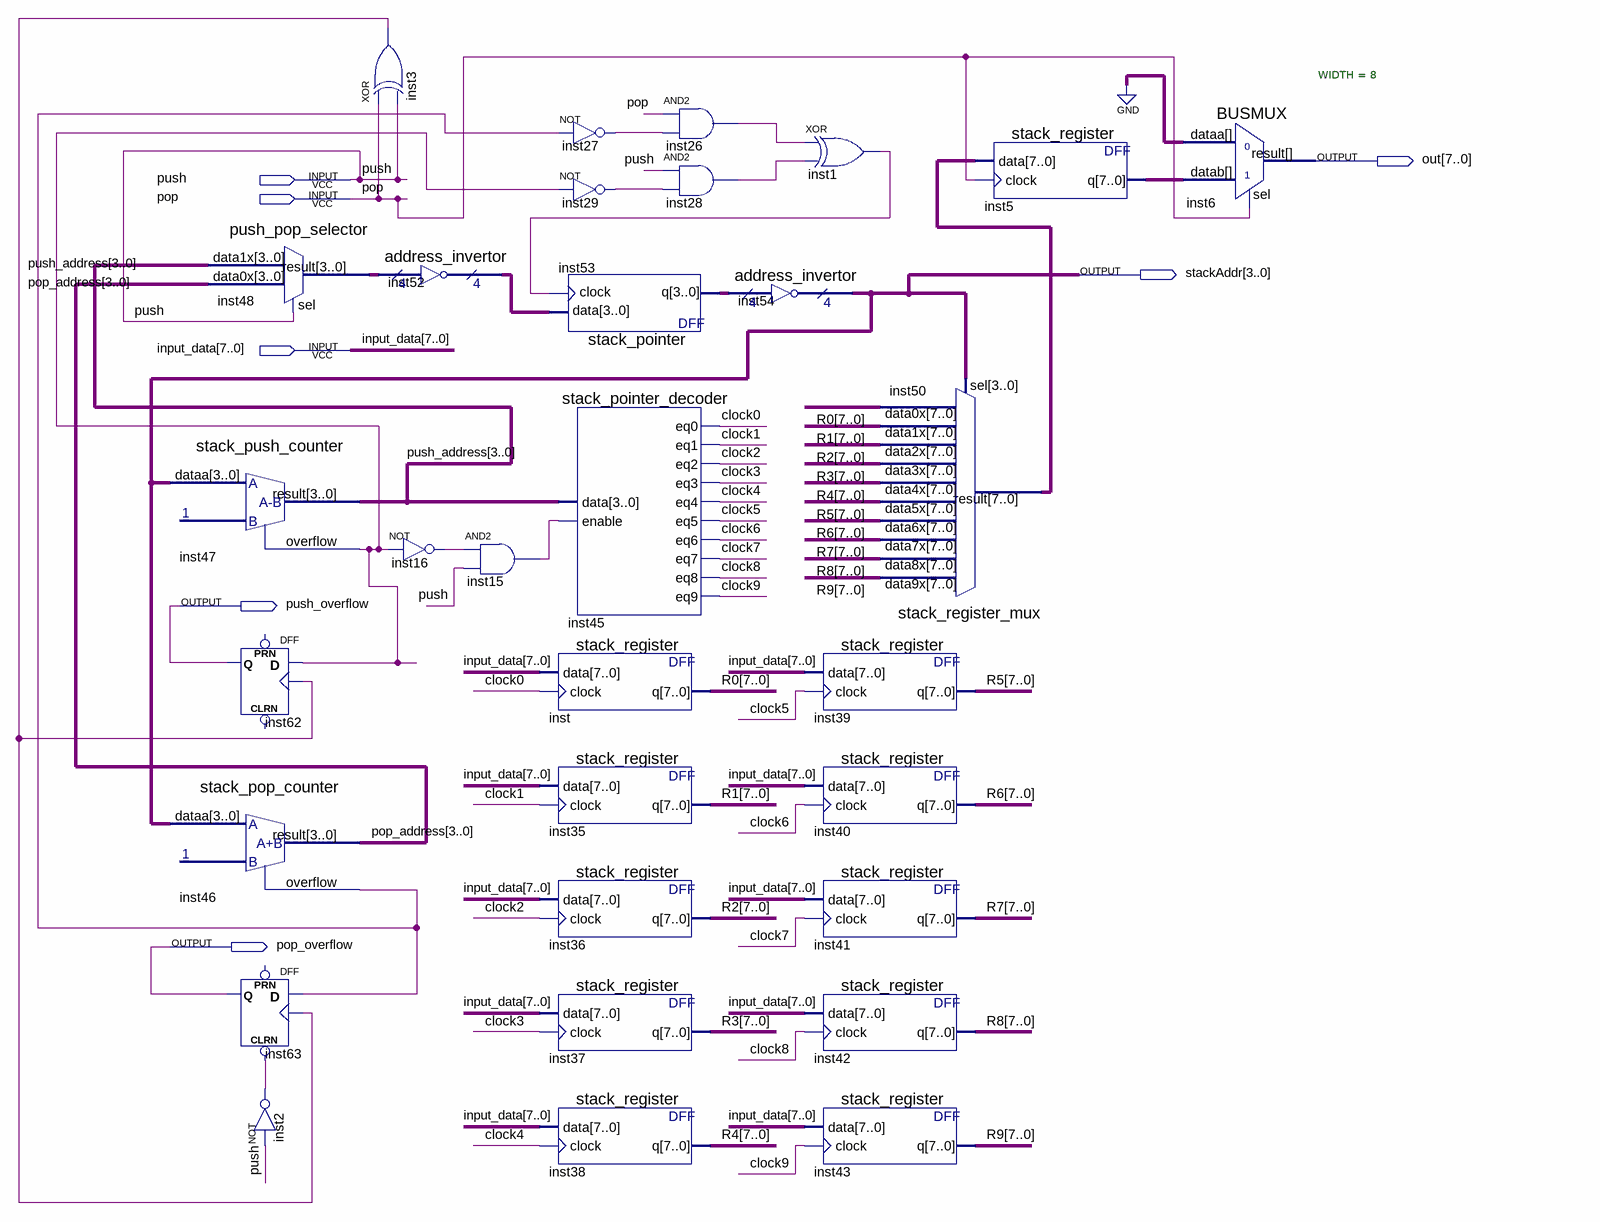
[diagram p0: schematic sheet]
// Quartus schematic STACK.bdf as structural Verilog: 31 symbols, 7 pins
module STACK (
  input  push,
  input  pop,
  input  [7:0] input_data,
  output [7:0] out,
  output [3:0] stackAddr,
  output push_overflow,
  output pop_overflow
);

  wire clock0, clock1, clock2, clock3, clock4, clock5, clock6, clock7, clock8, clock9, inst1_out, inst2_out,
       inst3_out, inst15_out, inst16_out, inst26_out, inst27_out, inst28_out, inst29_out, inst46_overflow,
       inst47_overflow;
  wire [3:0] inst48_result, inst52_result, inst53_q, pop_address, push_address;
  wire [7:0] inst5_q, inst50_result, R0, R1, R2, R3, R4, R5, R6, R7, R8, R9;

  stack_push_counter inst47 (.dataa(stackAddr), .result(push_address), .overflow(inst47_overflow));
  stack_pop_counter inst46 (.dataa(stackAddr), .result(pop_address), .overflow(inst46_overflow));
  push_pop_selector inst48 (.data1x(push_address), .data0x(pop_address), .sel(push), .result(inst48_result));
  DFF inst62 (.CLK(inst3_out), .D(inst47_overflow), .Q(push_overflow));  // open: CLRN, PRN
  DFF inst63 (.CLRN(inst2_out), .CLK(inst3_out), .D(inst46_overflow), .Q(pop_overflow));  // open: PRN
  not inst2 (inst2_out, push);
  xor inst3 (inst3_out, pop, push);
  address_invertor inst52 (.data(inst48_result), .result(inst52_result));
  not inst16 (inst16_out, inst47_overflow);
  and inst15 (inst15_out, inst16_out, push);
  not inst27 (inst27_out, inst46_overflow);
  not inst29 (inst29_out, inst47_overflow);
  stack_pointer inst53 (.data(inst52_result), .clock(inst1_out), .q(inst53_q));
  stack_pointer_decoder inst45 (
    .data(push_address), .enable(inst15_out), .eq0(clock0), .eq1(clock1), .eq2(clock2), .eq3(clock3),
    .eq4(clock4), .eq5(clock5), .eq6(clock6), .eq7(clock7), .eq8(clock8), .eq9(clock9));
  stack_register inst (.data(input_data), .clock(clock0), .q(R0));
  stack_register inst35 (.data(input_data), .clock(clock1), .q(R1));
  stack_register inst36 (.data(input_data), .clock(clock2), .q(R2));
  stack_register inst37 (.data(input_data), .clock(clock3), .q(R3));
  stack_register inst38 (.data(input_data), .clock(clock4), .q(R4));
  and inst26 (inst26_out, pop, inst27_out);
  and inst28 (inst28_out, push, inst29_out);
  address_invertor inst54 (.data(inst53_q), .result(stackAddr));
  xor inst1 (inst1_out, inst26_out, inst28_out);
  stack_register inst39 (.data(input_data), .clock(clock5), .q(R5));
  stack_register inst40 (.data(input_data), .clock(clock6), .q(R6));
  stack_register inst41 (.data(input_data), .clock(clock7), .q(R7));
  stack_register inst42 (.data(input_data), .clock(clock8), .q(R8));
  stack_register inst43 (.data(input_data), .clock(clock9), .q(R9));
  stack_register_mux inst50 (
    .data9x(R9), .data8x(R8), .data7x(R7), .data6x(R6), .data5x(R5), .data4x(R4), .data3x(R3), .data2x(R2),
    .data1x(R1), .data0x(R0), .sel(stackAddr), .result(inst50_result));
  stack_register inst5 (.data(inst50_result), .clock(pop), .q(inst5_q));
  BUSMUX #(.WIDTH(8)) inst6 (.datab(inst5_q), .sel(pop), .dataa({8{1'b0}}), .result(out));
endmodule
